# Altium schematic sheet prnet_v04_adxl362.SchDoc
size A
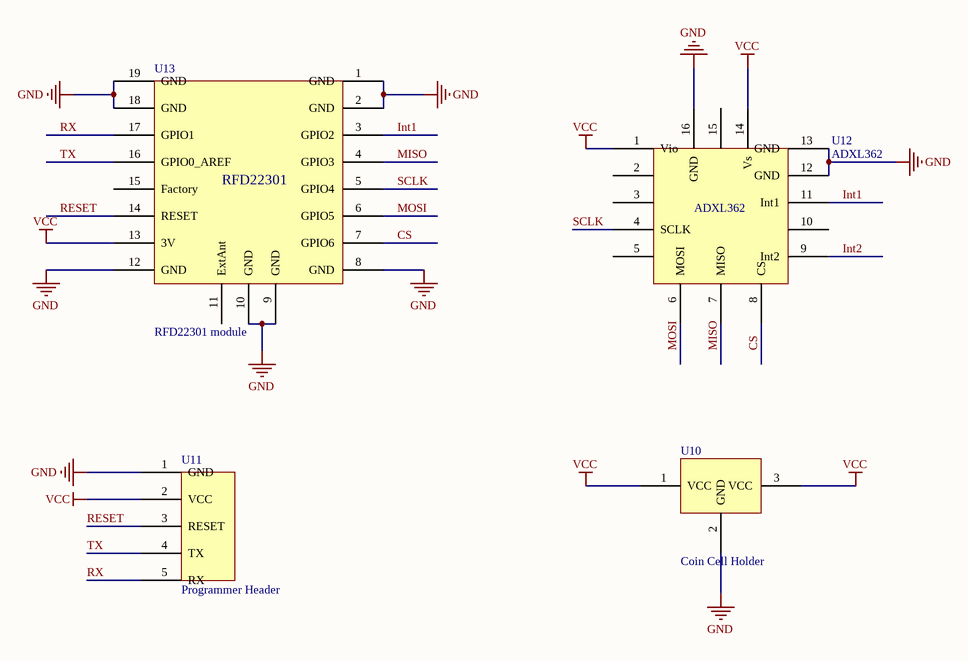
[diagram p0: prnet_v04_adxl362.SchDoc]

## Parts
U10  Coin Cell Holder  [CoinCell]
U11  Programmer Header  [PrgHeader]
U12  ADXL362  [ADXL362]
U13  RFD22301 module  [RFD22301]

## Nets
GND: U10.2(GND) U11.1(GND) U12.12(GND) U12.13(GND) U12.16(GND) U13.1(GND) U13.2(GND) U13.8(GND) U13.9(GND) U13.10(GND) U13.12(GND) U13.18(GND) U13.19(GND)
VCC: U10.1(VCC) U10.3(VCC) U11.2(VCC) U12.1(Vio) U12.14(Vs) U13.13(3V)
CS: U12.8(CS) U13.7(GPIO6)
Int1: U12.11(Int1) U13.3(GPIO2)
Int2: U12.9(Int2)
MISO: U12.7(MISO) U13.4(GPIO3)
MOSI: U12.6(MOSI) U13.6(GPIO5)
RESET: U11.3(RESET) U13.14(RESET)
RX: U11.5(RX) U13.17(GPIO1)
SCLK: U12.4(SCLK) U13.5(GPIO4)
TX: U11.4(TX) U13.16(GPIO0_AREF)

Not connected (* = marked no-connect by the designer): U12 2 3 5 10 15; U13 11(ExtAnt) 15(Factory)

## Notes on the sheet
- (in symbol RFD22301_Footprint) RFD22301

## Library data of the parts
U10 = CoinCellHolder
U11 = Component_1
U13 = RFD22301_Footprint